# Altium project Waffle.PrjPcb
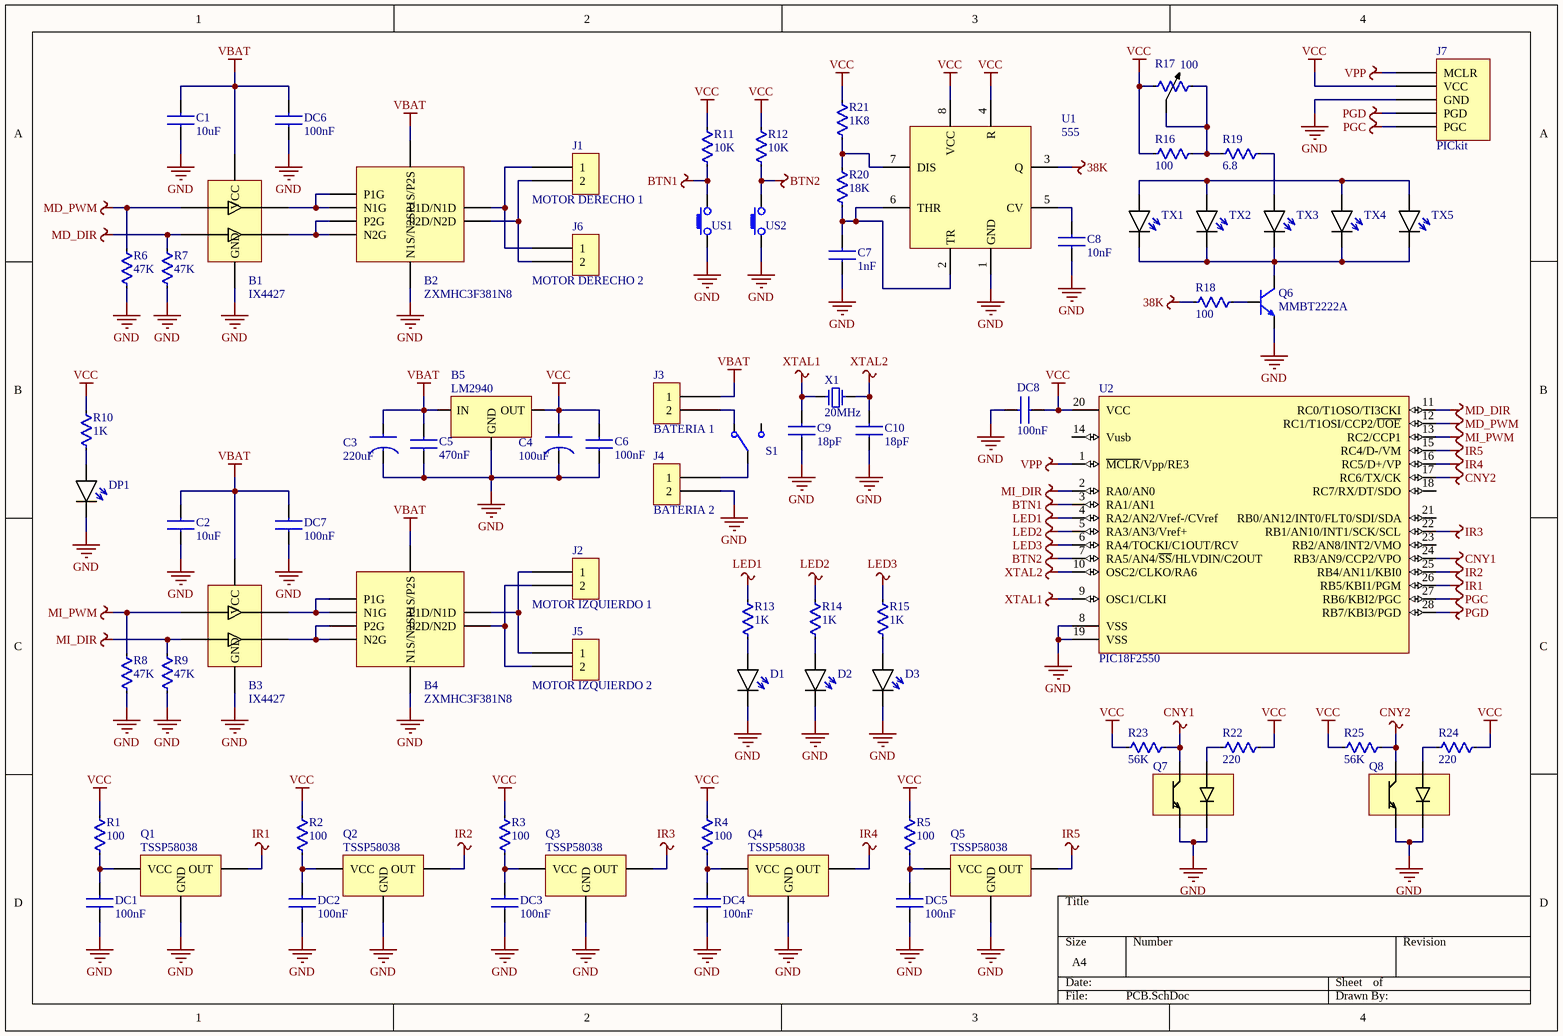
[diagram p0: PCB.SchDoc]
1 sheet, 78 parts. Net scope: global (net labels, ports and power ports of the same name join across sheets).
Board files: PCB.PcbDoc, PCB2.PcbDoc

## Sheet PCB.SchDoc
size A4; PageSetup: Record=PageOptions|CenterHorizontal=True|CenterVertical=True|PrintScale=1.00|XCorrection=1.00|YCorrection=1.00|PrintKind=0|BorderSize=5000000|LeftOffset=0|BottomOffset=0|Orientation=2|PaperLength=1000|PaperWidth=1000|Scale=100|PaperSource=7|PrintQuality=-3|MediaType=1|DitherType=10|PrintScaleMode=1|PaperKind=A4|PaperIndex=9

### Parts
B1  IX4427  [SOIC-8]
B2  ZXMHC3F381N8  [SOIC-8]
B3  IX4427  [SOIC-8]
B4  ZXMHC3F381N8  [SOIC-8]
B5  LM2940  [TO-263]
C1  value 10uF  [C1206]  (hidden comment: CAP-CER)
C2  value 10uF  [C1206]  (hidden comment: CAP-CER)
C3  value 220uF  [CAP-ELEC-5x11x2mm]  (hidden comment: CAP-ELEC)
C4  value 100uF  [CAP-ELEC-5x11x2mm]  (hidden comment: CAP-ELEC)
C5  value 470nF  [C1206]  (hidden comment: CAP-CER)
C6  value 100nF  [C1206]  (hidden comment: CAP-CER)
C7  value 1nF  [C1206]  (hidden comment: CAP-CER)
C8  value 10nF  [C1206]  (hidden comment: CAP-CER)
C9  value 18pF  [C1206]  (hidden comment: CAP-CER)
C10  value 18pF  [C1206]  (hidden comment: CAP-CER)
D1  LED  [LED-3MM-RED]  (value not drawn)
D2  LED  [LED-3MM-YELLOW]  (value not drawn)
D3  LED  [LED-3MM-GREEN]  (value not drawn)
DC1  value 100nF  [C1206]  (hidden comment: CAP-CER)
DC2  value 100nF  [C1206]  (hidden comment: CAP-CER)
DC3  value 100nF  [C1206]  (hidden comment: CAP-CER)
DC4  value 100nF  [C1206]  (hidden comment: CAP-CER)
DC5  value 100nF  [C1206]  (hidden comment: CAP-CER)
DC6  value 100nF  [C1206]  (hidden comment: CAP-CER)
DC7  value 100nF  [C1206]  (hidden comment: CAP-CER)
DC8  value 100nF  [C1206]  (hidden comment: CAP-CER)
DP1  LED  [LED-3MM-RED]  (value not drawn)
J1  MOTOR DERECHO 1  [HEADER 1x2]
J2  MOTOR IZQUIERDO 1  [HEADER 1x2]
J3  BATERIA 1  [HEADER 1x2]
J4  BATERIA 2  [HEADER 1x2]
J5  MOTOR IZQUIERDO 2  [HEADER 1x2]
J6  MOTOR DERECHO 2  [HEADER 1x2]
J7  PICkit  [Header 1x5]
Q1  TSSP58038  [TSSP58038]
Q2  TSSP58038  [TSSP58038]
Q3  TSSP58038  [TSSP58038]
Q4  TSSP58038  [TSSP58038]
Q5  TSSP58038  [TSSP58038]
Q6  MMBT2222A  [SOT-23]
Q7  QRE1113GR  [QRE1113GR]  (value not drawn)
Q8  QRE1113GR  [QRE1113GR]  (value not drawn)
R1  value 100  [R1206]  (hidden comment: RES)
R2  value 100  [R1206]  (hidden comment: RES)
R3  value 100  [R1206]  (hidden comment: RES)
R4  value 100  [R1206]  (hidden comment: RES)
R5  value 100  [R1206]  (hidden comment: RES)
R6  value 47K  [R1206]  (hidden comment: RES)
R7  value 47K  [R1206]  (hidden comment: RES)
R8  value 47K  [R1206]  (hidden comment: RES)
R9  value 47K  [R1206]  (hidden comment: RES)
R10  value 1K  [R1206]  (hidden comment: RES)
R11  value 10K  [R1206]  (hidden comment: RES)
R12  value 10K  [R1206]  (hidden comment: RES)
R13  value 1K  [R1206]  (hidden comment: RES)
R14  value 1K  [R1206]  (hidden comment: RES)
R15  value 1K  [R1206]  (hidden comment: RES)
R16  value 100  [R1206]  (hidden comment: RES)
R17  value 100  [TRIMPOT]  (hidden comment: POT)
R18  value 100  [R1206]  (hidden comment: RES)
R19  value 6.8  [R1206]  (hidden comment: RES)
R20  value 18K  [R1206]  (hidden comment: RES)
R21  value 1K8  [R1206]  (hidden comment: RES)
R22  value 220  [R1206]  (hidden comment: RES)
R23  value 56K  [R1206]  (hidden comment: RES)
R24  value 220  [R1206]  (hidden comment: RES)
R25  value 56K  [R1206]  (hidden comment: RES)
S1  SLIDE-SWITCH  [SWITCH]  (value not drawn)
TX1  LED  [LED-5MM-CLEAR]  (value not drawn)
TX2  LED  [LED-5MM-CLEAR]  (value not drawn)
TX3  LED  [LED-5MM-CLEAR]  (value not drawn)
TX4  LED  [LED-5MM-CLEAR]  (value not drawn)
TX5  LED  [LED-5MM-CLEAR]  (value not drawn)
U1  555  [SOIC-8]
U2  PIC18F2550  [SOIC-SO28_N]
US1  BUTTON  [TACT_SWITCH-SMALL-4PIN]  (value not drawn)
US2  BUTTON  [TACT_SWITCH-SMALL-4PIN]  (value not drawn)
X1  FREQUENCY: 20MHz  [HC-49/S]  (hidden comment: XTAL)

### Nets
38K: R18.1 U1.3(Q)
BTN1: R11.1 U2.3(RA1/AN1) US1.2
BTN2: R12.1 U2.7(RA5/AN4/~{SS}/HLVDIN/C2OUT) US2.2
CNY1: Q7.C R23.1 U2.24(RB3/AN9/CCP2/VPO)
CNY2: Q8.C R25.1 U2.17(RC6/TX/CK)
GND: B1.3(GND) B2.3(N1S/N2S) B3.3(GND) B4.3(N1S/N2S) B5.2(GND) C1.2 C2.2 C3.2 C4.2 C5.1 C6.1 C7.1 C8.1 C9.1 C10.1 D1.K D2.K D3.K DC1.2 DC2.2 DC3.2 DC4.2 DC5.2 DC6.2 DC7.2 DC8.1 DP1.K J4.2 J7.3(GND) Q1.2(GND) Q2.2(GND) Q3.2(GND) Q4.2(GND) Q5.2(GND) Q6.E Q7.E Q7.K Q8.E Q8.K R6.1 R7.1 R8.1 R9.1 U1.1(GND) U2.8(VSS) U2.19(VSS) US1.1 US2.1
IR1: Q1.1(OUT) U2.26(RB5/KBI1/PGM)
IR2: Q2.1(OUT) U2.25(RB4/AN11/KBI0)
IR3: Q3.1(OUT) U2.22(RB1/AN10/INT1/SCK/SCL)
IR4: Q4.1(OUT) U2.16(RC5/D+/VP)
IR5: Q5.1(OUT) U2.15(RC4/D-/VM)
LED1: R13.2 U2.4(RA2/AN2/Vref-/CVref)
LED2: R14.2 U2.5(RA3/AN3/Vref+)
LED3: R15.2 U2.6(RA4/TOCKI/C1OUT/RCV)
MD_DIR: B1.4(INB) R7.2 U2.11(RC0/T1OSO/TI3CKI)
MD_PWM: B1.2(INA) R6.2 U2.12(RC1/T1OSI/CCP2/~{UOE})
MI_DIR: B3.4(INB) R9.2 U2.2(RA0/AN0)
MI_PWM: B3.2(INA) R8.2 U2.13(RC2/CCP1)
PGC: J7.5(PGC) U2.27(RB6/KBI2/PGC)
PGD: J7.4(PGD) U2.28(RB7/KBI3/PGD)
VBAT: B1.6(VCC) B2.7(P1S/P2S) B3.6(VCC) B4.7(P1S/P2S) B5.1(IN) C1.1 C2.1 C3.1 C5.2 DC6.1 DC7.1 J3.1
VCC: B5.3(OUT) C4.1 C6.2 DC8.2 J7.2(VCC) R1.2 R2.2 R3.2 R4.2 R5.2 R10.2 R11.2 R12.2 R16.2 R17.3 R21.2 R22.1 R23.2 R24.1 R25.2 U1.4(R) U1.8(VCC) U2.20(VCC)
VPP: J7.1(MCLR) U2.1(~{MCLR}/Vpp/RE3)
XTAL1: C9.2 U2.9(OSC1/CLKI) X1.2
XTAL2: C10.2 U2.10(OSC2/CLKO/RA6) X1.1
NetB1_5: B1.5(OUTB) B2.4(N2G) B2.5(P2G)
NetB1_7: B1.7(OUTA) B2.1(N1G) B2.8(P1G)
NetB2_2: B2.2(P1D/N1D) J1.1 J6.1
NetB2_6: B2.6(P2D/N2D) J1.2 J6.2
NetB3_5: B3.5(OUTB) B4.4(N2G) B4.5(P2G)
NetB3_7: B3.7(OUTA) B4.1(N1G) B4.8(P1G)
NetB4_2: B4.2(P1D/N1D) J2.1 J5.1
NetB4_6: B4.6(P2D/N2D) J2.2 J5.2
NetC7_2: C7.2 R20.1 U1.2(TR) U1.6(THR)
NetC8_2: C8.2 U1.5(CV)
NetD1_A: D1.A R13.1
NetD2_A: D2.A R14.1
NetD3_A: D3.A R15.1
NetDC1_1: DC1.1 Q1.3(VCC) R1.1
NetDC2_1: DC2.1 Q2.3(VCC) R2.1
NetDC3_1: DC3.1 Q3.3(VCC) R3.1
NetDC4_1: DC4.1 Q4.3(VCC) R4.1
NetDC5_1: DC5.1 Q5.3(VCC) R5.1
NetDP1_A: DP1.A R10.1
NetJ3_2: J3.2 S1.1
NetJ4_1: J4.1 S1.2
NetQ6_B: Q6.B R18.2
NetQ6_C: Q6.C TX1.K TX2.K TX3.K TX4.K TX5.K
NetQ7_A: Q7.A R22.2
NetQ8_A: Q8.A R24.2
NetR16_1: R16.1 R17.1 R17.2 R19.2
NetR19_1: R19.1 TX3.A
NetR20_2: R20.2 R21.1 U1.7(DIS)
NetTX1_A: TX1.A TX2.A TX4.A TX5.A

Not connected (* = marked no-connect by the designer): S1 3; U2 14(Vusb) 18(RC7/RX/DT/SDO) 21(RB0/AN12/INT0/FLT0/SDI/SDA) 23(RB2/AN8/INT2/VMO)

### Library data of the parts
B1 B3 = 4427
J1-J6 = Header 1x2
Q6 = NPN
Q7 Q8 = QRE1113GR: MF: ON Semiconductor; Price: 0.46 USD; MP: QRE1113GR; Package: SMD-4 ON Semiconductor; Availability: Good; Value: *